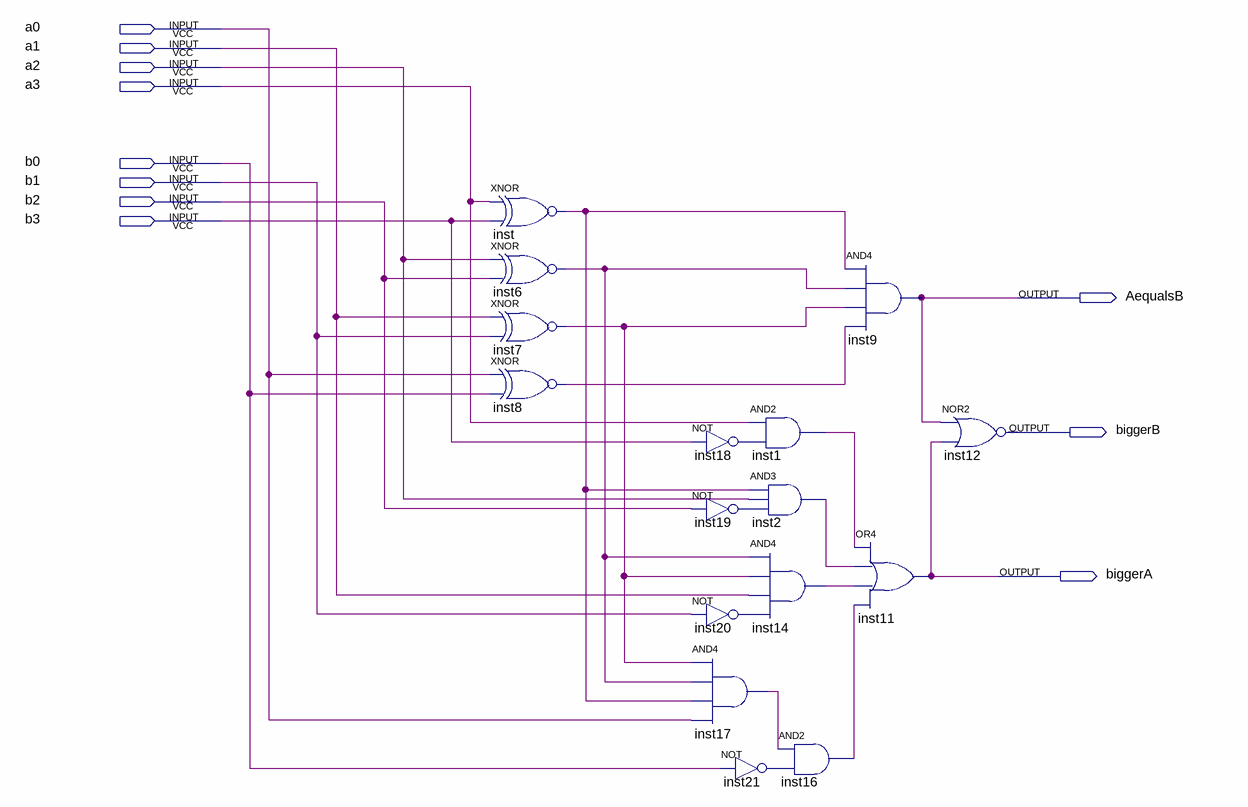
[diagram p0: schematic sheet]
// Quartus schematic comparador-sd.bdf as structural Verilog: 16 symbols, 11 pins
module \comparador-sd  (
  input  a0,
  input  a1,
  input  a2,
  input  a3,
  input  b0,
  input  b1,
  input  b2,
  input  b3,
  output AequalsB,
  output biggerB,
  output biggerA
);

  wire inst1_out, inst2_out, inst6_out, inst7_out, inst8_out, inst14_out, inst16_out, inst17_out, inst18_out,
       inst19_out, inst20_out, inst21_out, inst_out;

  xnor inst (inst_out, a3, b3);
  xnor inst6 (inst6_out, a2, b2);
  xnor inst7 (inst7_out, a1, b1);
  xnor inst8 (inst8_out, a0, b0);
  not inst18 (inst18_out, b3);
  not inst19 (inst19_out, b2);
  not inst20 (inst20_out, b1);
  and inst17 (inst17_out, inst7_out, inst6_out, inst_out, a0);
  not inst21 (inst21_out, b0);
  and inst1 (inst1_out, a3, inst18_out);
  and inst2 (inst2_out, inst_out, a2, inst19_out);
  and inst14 (inst14_out, inst6_out, inst7_out, a1, inst20_out);
  and inst16 (inst16_out, inst17_out, inst21_out);
  and inst9 (AequalsB, inst_out, inst6_out, inst7_out, inst8_out);
  or inst11 (biggerA, inst1_out, inst2_out, inst14_out, inst16_out);
  nor inst12 (biggerB, AequalsB, biggerA);
endmodule
